# Altium schematic sheet LT1807CS8#PBF.schdoc
size 54 x 35 mm
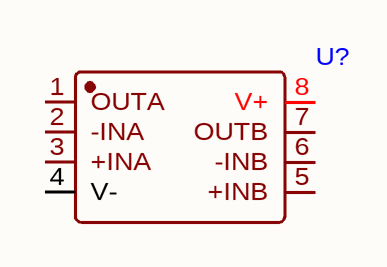
[diagram p0: LT1807CS8#PBF.schdoc]

## Parts
U?  (no value)  [SOIC-8_L5.0-W4.0-P1.27-LS6.0-BL]

## Nets

Not connected (* = marked no-connect by the designer): U? 1(OUTA) 2(-INA) 3(+INA) 4(V-) 5(+INB) 6(-INB) 7(OUTB) 8(V+)

## Library data of the parts
U? = LT1807CS8#PBF